# Altium schematic sheet PG05_Power Conversions.SchDoc
size B
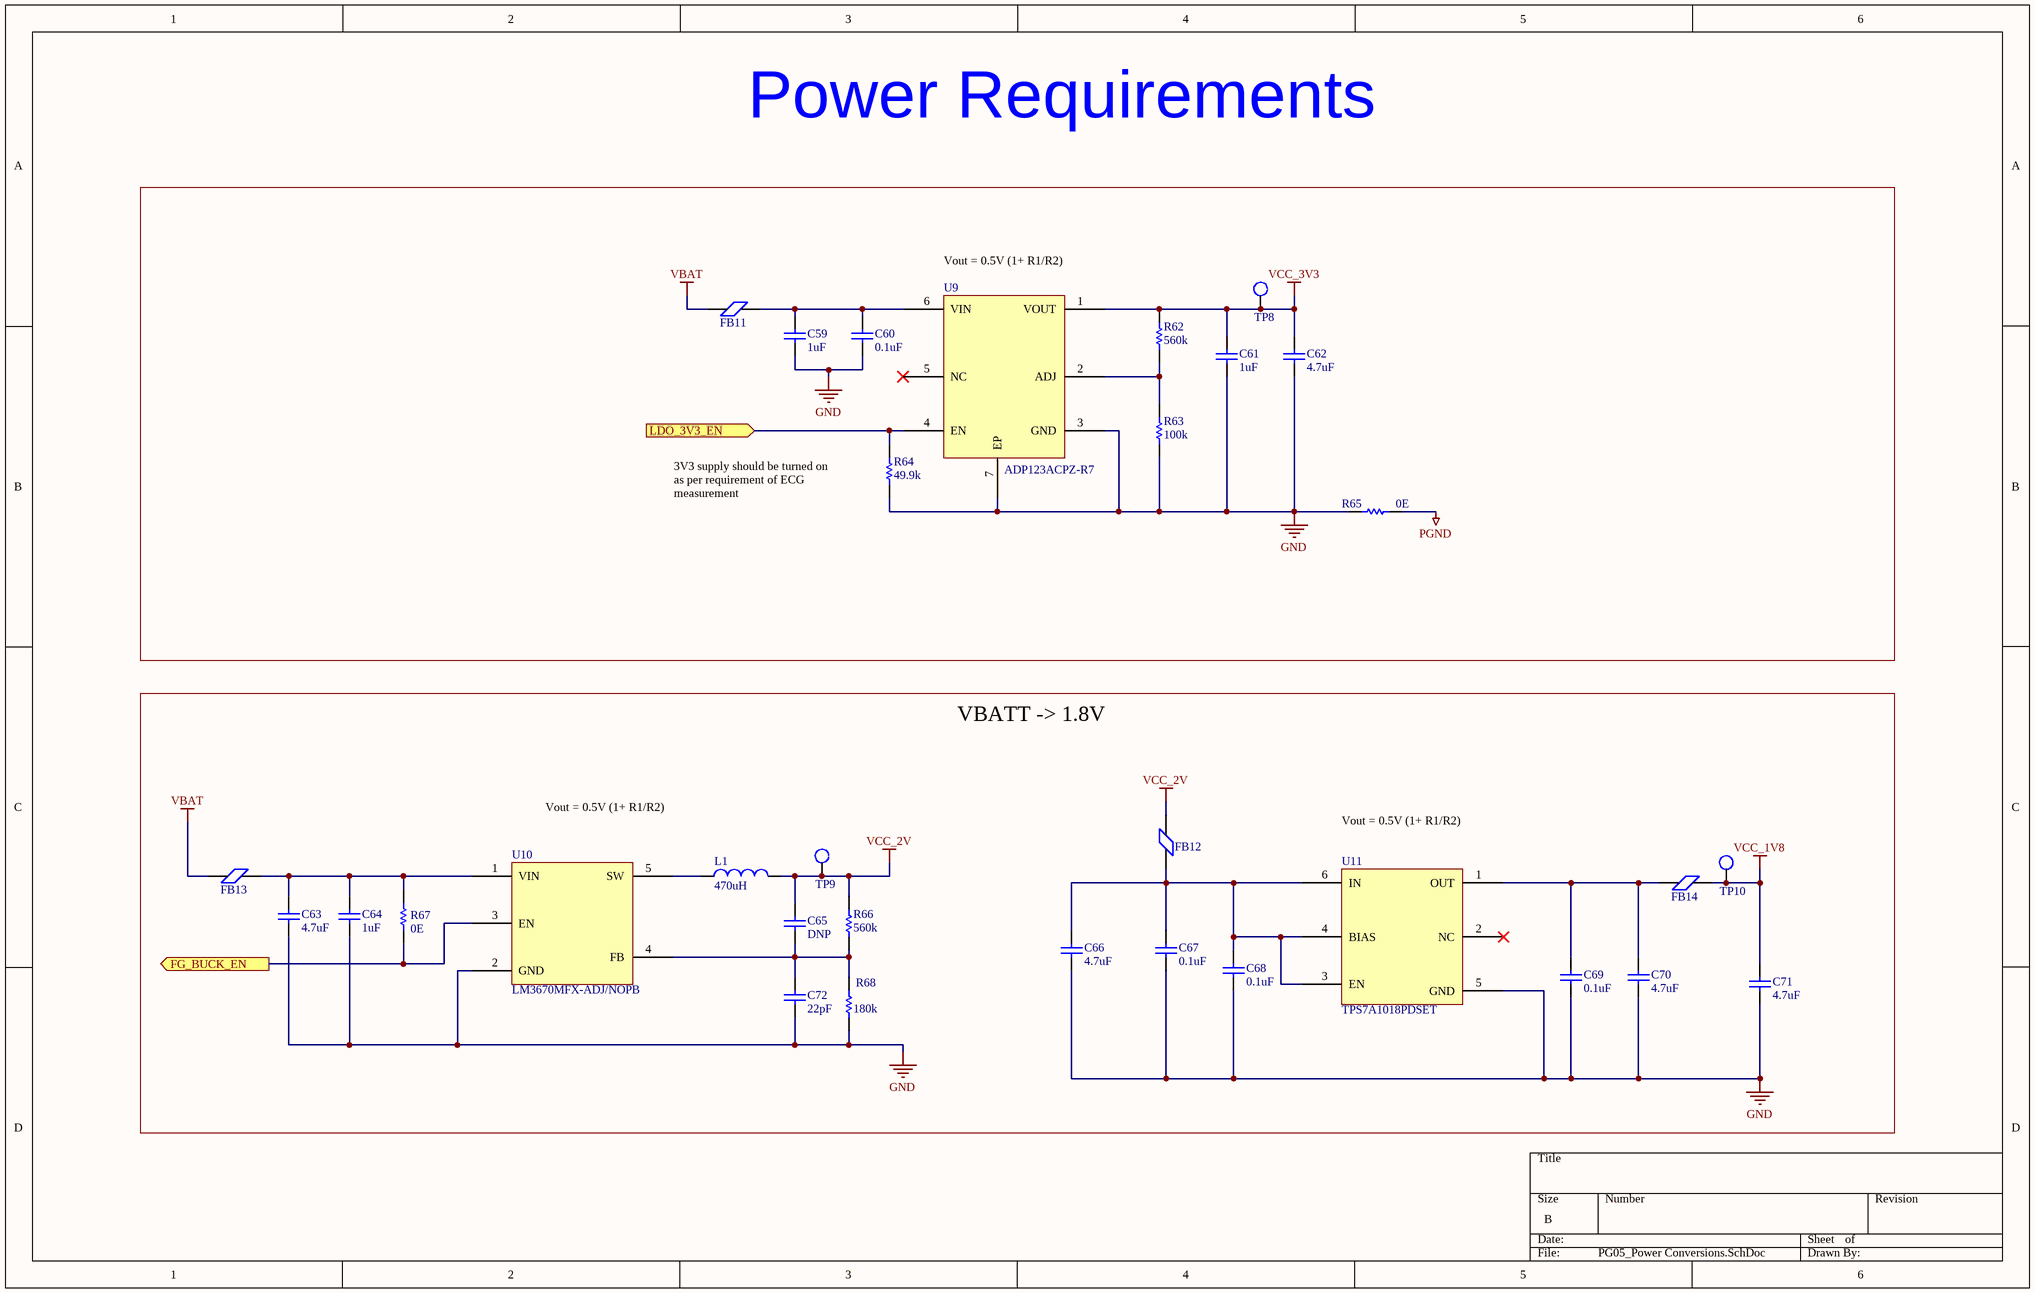
[diagram p0: PG05_Power Conversions.SchDoc]

## Parts
C59  1uF  [0805C]
C60  0.1uF  [0402C]
C61  1uF  [0805C]
C62  4.7uF  [0805C]
C63  4.7uF  [0805C]
C64  1uF  [0805C]
C65  DNP  [0402C]
C66  4.7uF  [0805C]
C67  0.1uF  [0402C]
C68  0.1uF  [0402C]
C69  0.1uF  [0402C]
C70  4.7uF  [0805C]
C71  4.7uF  [0805C]
C72  22pF  [0402C]
FB11  Ferrite Bead  [0402R]  (value not drawn)
FB12  Ferrite Bead  [0402R]  (value not drawn)
FB13  Ferrite Bead  [0402R]  (value not drawn)
FB14  Ferrite Bead  [0402R]  (value not drawn)
L1  470uH  [NR6028T3R0N]
R62  560k  [0402R]
R63  100k  [0402R]
R64  49.9k  [0402R]
R65  0E  [0402R]
R66  560k  [0402R]
R67  0E  [0402R]
R68  180k  [0402R]
TP8  Test_Point  [TP]  (value not drawn)
TP9  Test_Point  [TP]  (value not drawn)
TP10  Test_Point  [TP]  (value not drawn)
U9  ADP123ACPZ-R7  [ADP123ACPZ-R7]
U10  LM3670MFX-ADJ/NOPB  [LM3670MFX-ADJ/NOPB]
U11  TPS7A1018PDSET  [TPS7A1018PDSET]

## Blocks framed on the sheet
Vout = 0.5V (1+ R1/R2): C59-C62 FB11 R62-R65 TP8 U9
VBATT -> 1.8V: C63-C72 FB12-FB14 L1 R66-R68 TP9 TP10 U10 U11

## Ports
FG_BUCK_EN (out), LDO_3V3_EN (in)

## Nets
GND: C59.1 C60.1 C61.1 C62.1 C63.1 C64.1 C66.1 C67.1 C68.1 C69.1 C70.1 C71.1 C72.1 R63.1 R64.1 R65.1 R68.1 U9.3(GND) U9.7(EP) U10.2(GND) U11.5(GND)
PGND: R65.2
VBAT: FB11.1(VREF) FB13.1(VREF)
VCC_1V8: C71.2 FB14.2(VREF) TP10.1
VCC_2V: C65.1 FB12.2(VREF) L1.2 R66.2 TP9.1
VCC_3V3: C61.2 C62.2 R62.2 TP8.1 U9.1(VOUT)
FG_BUCK_EN: R67.1 U10.3(EN) ; port FG_BUCK_EN
LDO_3V3_EN: R64.2 U9.4(EN) ; port LDO_3V3_EN
NetC59_2: C59.2 C60.2 FB11.2(VREF) U9.6(VIN)
NetC63_2: C63.2 C64.2 FB13.2(VREF) R67.2 U10.1(VIN)
NetC65_2: C65.2 C72.2 R66.1 R68.2 U10.4(FB)
NetC66_2: C66.2 C67.2 C68.2 FB12.1(VREF) U11.3(EN) U11.4(BIAS) U11.6(IN)
NetC69_2: C69.2 C70.2 FB14.1(VREF) U11.1(OUT)
NetL1_1: L1.1 U10.5(SW)
NetR62_1: R62.1 R63.2 U9.2(ADJ)

Not connected (* = marked no-connect by the designer): U9 5(NC)*; U11 2(NC)*

## Notes on the sheet
- Power Requirements
- 3V3 supply should be turned on as per requirement of ECG measurement
- Vout = 0.5V (1+ R1/R2)

## Library data of the parts
C59 C61 C64 = CAP_0805_1uF_25V: CAP CER 1UF 25V X7R 0805; Alternate MFR: Würth Elektronik; Alternate MPN: 885012207078; Package: 0805; Value: 1uF
C60 C67-C69 = CAP_0402_0.1uF_50V: CAP CER 0.1UF 50V X7R 0402; Alternate MFR: Samsung Electro-Mechanics; Alternate MPN: CL05B104KB54PNC; Package: 0402; Value: 0.1uF
C62 C63 C66 C70 C71 = CAP_0805_4.7uF_16V: CAP CER MLCC 4.7uF X7R 16V  0805; Alternate MFR: Murata Electronics; Alternate MPN: GRM21BR71C475ME51K; Package: 0805; Value: 4.7uF
C65 = CAP_0402_DNP: CAP CER DNP 0402; MFR: Generic; MPN: Generic; Package: 0402; Value: DNP
C72 = CAP_0402_22pF: CAP CER 22PF 50V C0G 0402; MFR: Generic; Alternate MFR: TDK Corporation; Alternate MPN: C1005C0G1H220J050BA; MPN: Generic; Package: 0402; Value: 22pF
FB11-FB14 = Ferrite Bead: CHIP BEAD 600 OHM 0402 300mA; MFR: Walsin; MPN: WLBD1005K2U601TP; Package: 0402
L1 = IND_470uH: FIXED IND 470UH 105MA 14.3OHM SM; MFR: Bourns; MPN: SDR0302-471KL; Package: 0302; Alternate MFR: *; Alternate MPN: *; Value: 470uH
R62 R66 = RES_0402_560k: RES 560K OHM 1% 1/16W 0402; MFR: Generic; Alternate MFR: YAGEO; Alternate MPN: RC0402FR-07560KL; MPN: Generic; Package: 0402; Value: 560k
R63 = RES_0402_100k: RES 100K OHM 1% 1/16W 0402; MFR: Generic; Alternate MFR: YAGEO; Alternate MPN: RC0402FR-07100KP; MPN: Generic; Package: 0402; Value: 100k
R64 = RES_0402_49.9k: RES 49.9K OHM 1% 1/16W 0402; MFR: Generic; Alternate MFR: YAGEO; Alternate MPN: RC0402FR-0749K9L; MPN: Generic; Package: 0402; Value: 49.9k
R65 R67 = RES_0402_0E: RES 0 OHM JUMPER 1/16W 0402; MFR: Generic; Alternate MFR: YAGEO; Alternate MPN: AC0402JR-130RL; MPN: Generic; Package: 0402; Value: 0E
R68 = RES_0402_180k: RES 180K OHM 1% 1/16W 0402; MFR: Generic; Alternate MFR: YAGEO; Alternate MPN: RC0402FR-07180KL; MPN: Generic; Package: 0402; Value: 180k
U9 = LDO_ADP123ACPZ-R7: IC REG LIN POS ADJ 300MA 6LFCSP; MFR: Analog Devices; MPN: ADP123ACPZ-R7; Package: 6-LFCSP-UD (2x2)
U10 = Buck_LM3670MFX-ADJ/NOPB: IC REG BUCK ADJ 350MA SOT23-5; MFR: Texas Instruments; MPN: LM3670MFX-ADJ/NOPB; Package: SOT-23-5
U11 = LDO_TPS7A1018PDSET: IC REG LINEAR 1.8V 300MA 6WSON; MFR: TI; MPN: TPS7A1018PDSET; Package: 6-WSON (1.5x1.5)